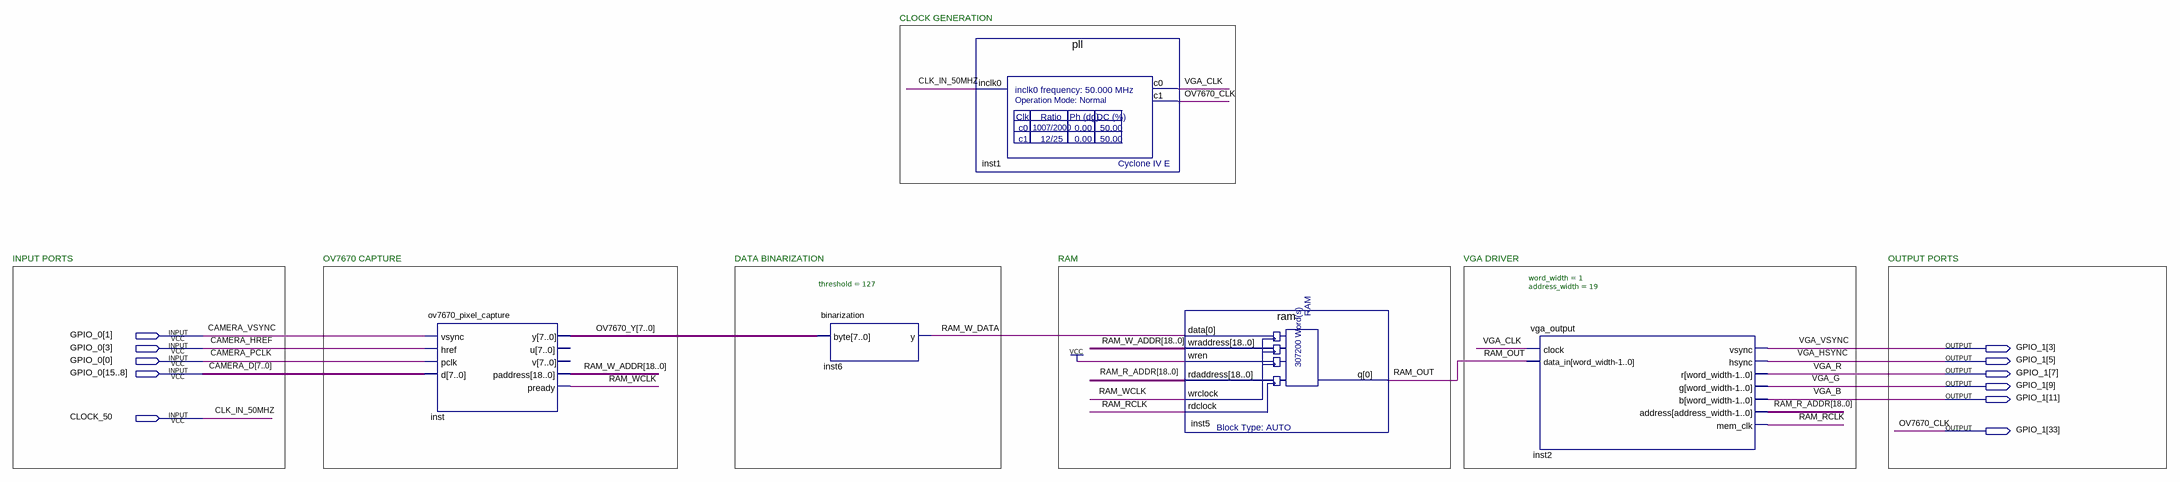
[diagram p0: schematic sheet]
// Quartus schematic cyclops_wire.bdf as structural Verilog: 5 symbols, 11 pins
module cyclops_wire (
  input  [15:0] GPIO_0,
  input  CLOCK_50,
  output [33:3] GPIO_1
);

  wire RAM_OUT, RAM_RCLK, RAM_W_DATA, RAM_WCLK, VGA_CLK;
  wire [7:0] OV7670_Y;
  wire [18:0] RAM_R_ADDR, RAM_W_ADDR;

  ov7670_pixel_capture inst (
    .vsync(GPIO_0[1]), .href(GPIO_0[3]), .pclk(GPIO_0[0]), .d(GPIO_0[15:8]), .y(OV7670_Y),
    .paddress(RAM_W_ADDR), .pready(RAM_WCLK));  // open: u, v
  binarization #(.threshold(127)) inst6 (.\byte (OV7670_Y), .y(RAM_W_DATA));
  pll inst1 (.inclk0(CLOCK_50), .c0(VGA_CLK), .c1(GPIO_1[33]));
  ram inst5 (
    .data(RAM_W_DATA), .wraddress(RAM_W_ADDR), .wren(1'b1), .rdaddress(RAM_R_ADDR), .wrclock(RAM_WCLK),
    .rdclock(RAM_RCLK), .q(RAM_OUT));
  vga_output #(.word_width(1), .address_width(19)) inst2 (
    .clock(VGA_CLK), .data_in(RAM_OUT), .vsync(GPIO_1[3]), .hsync(GPIO_1[5]), .r(GPIO_1[7]), .g(GPIO_1[9]),
    .b(GPIO_1[11]), .address(RAM_R_ADDR), .mem_clk(RAM_RCLK));

  // Other names for the same wires on the sheet: CAMERA_D[7:0] = GPIO_0[15:8]; CAMERA_HREF = GPIO_0[3];
  //   CAMERA_PCLK = GPIO_0[0]; CAMERA_VSYNC = GPIO_0[1]; CLK_IN_50MHZ = CLOCK_50; OV7670_CLK = GPIO_1[33];
  //   VGA_B = GPIO_1[11]; VGA_G = GPIO_1[9]; VGA_HSYNC = GPIO_1[5]; VGA_R = GPIO_1[7]; VGA_VSYNC = GPIO_1[3]

  // Notes on the sheet:
  //   CLOCK GENERATION
  //   INPUT PORTS
  //   OV7670 CAPTURE
  //   DATA BINARIZATION
  //   RAM
  //   VGA DRIVER
  //   OUTPUT PORTS
endmodule
